# EAGLE board FresqueRVB (EAGLE 6.1), part 1 of 2
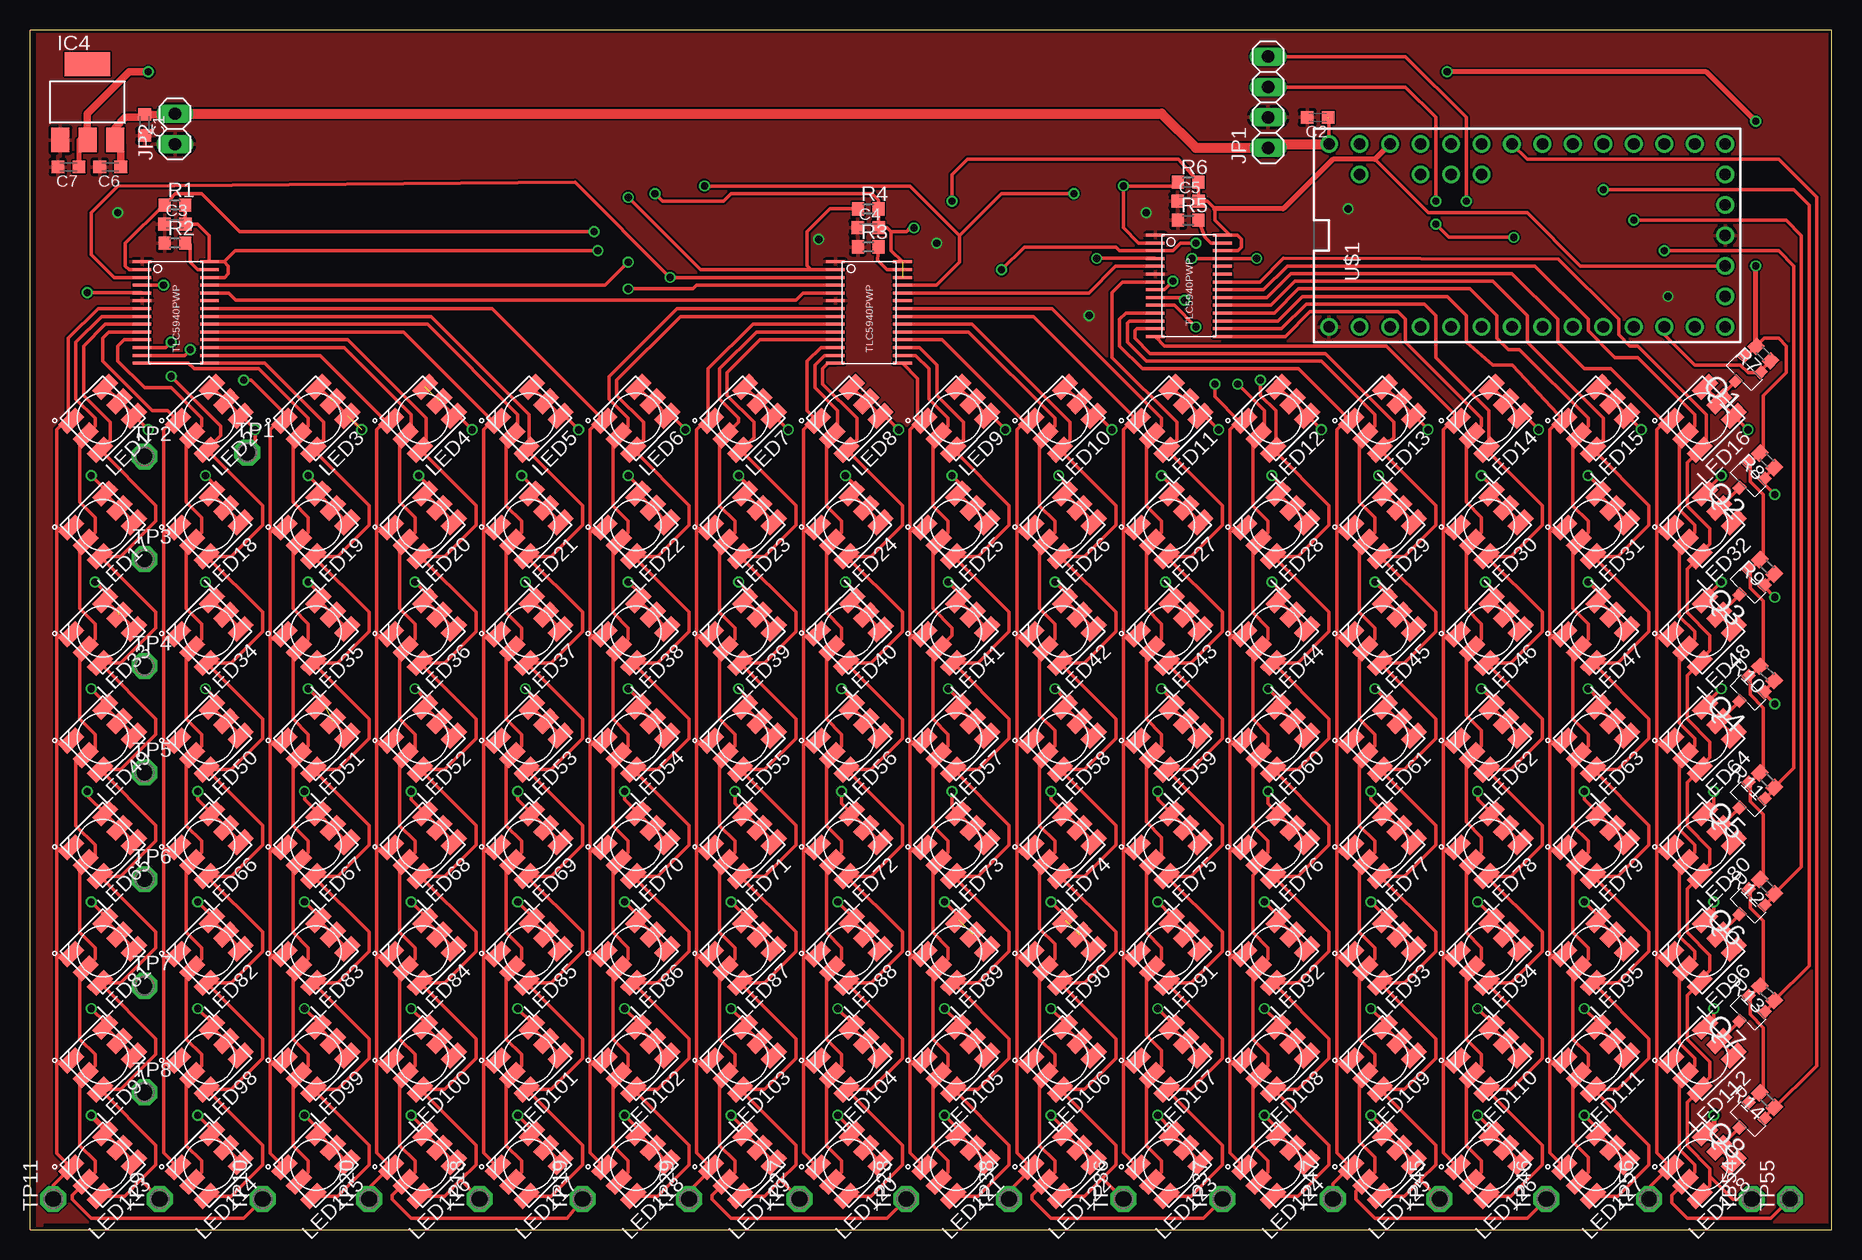
[diagram p1: board, top side]
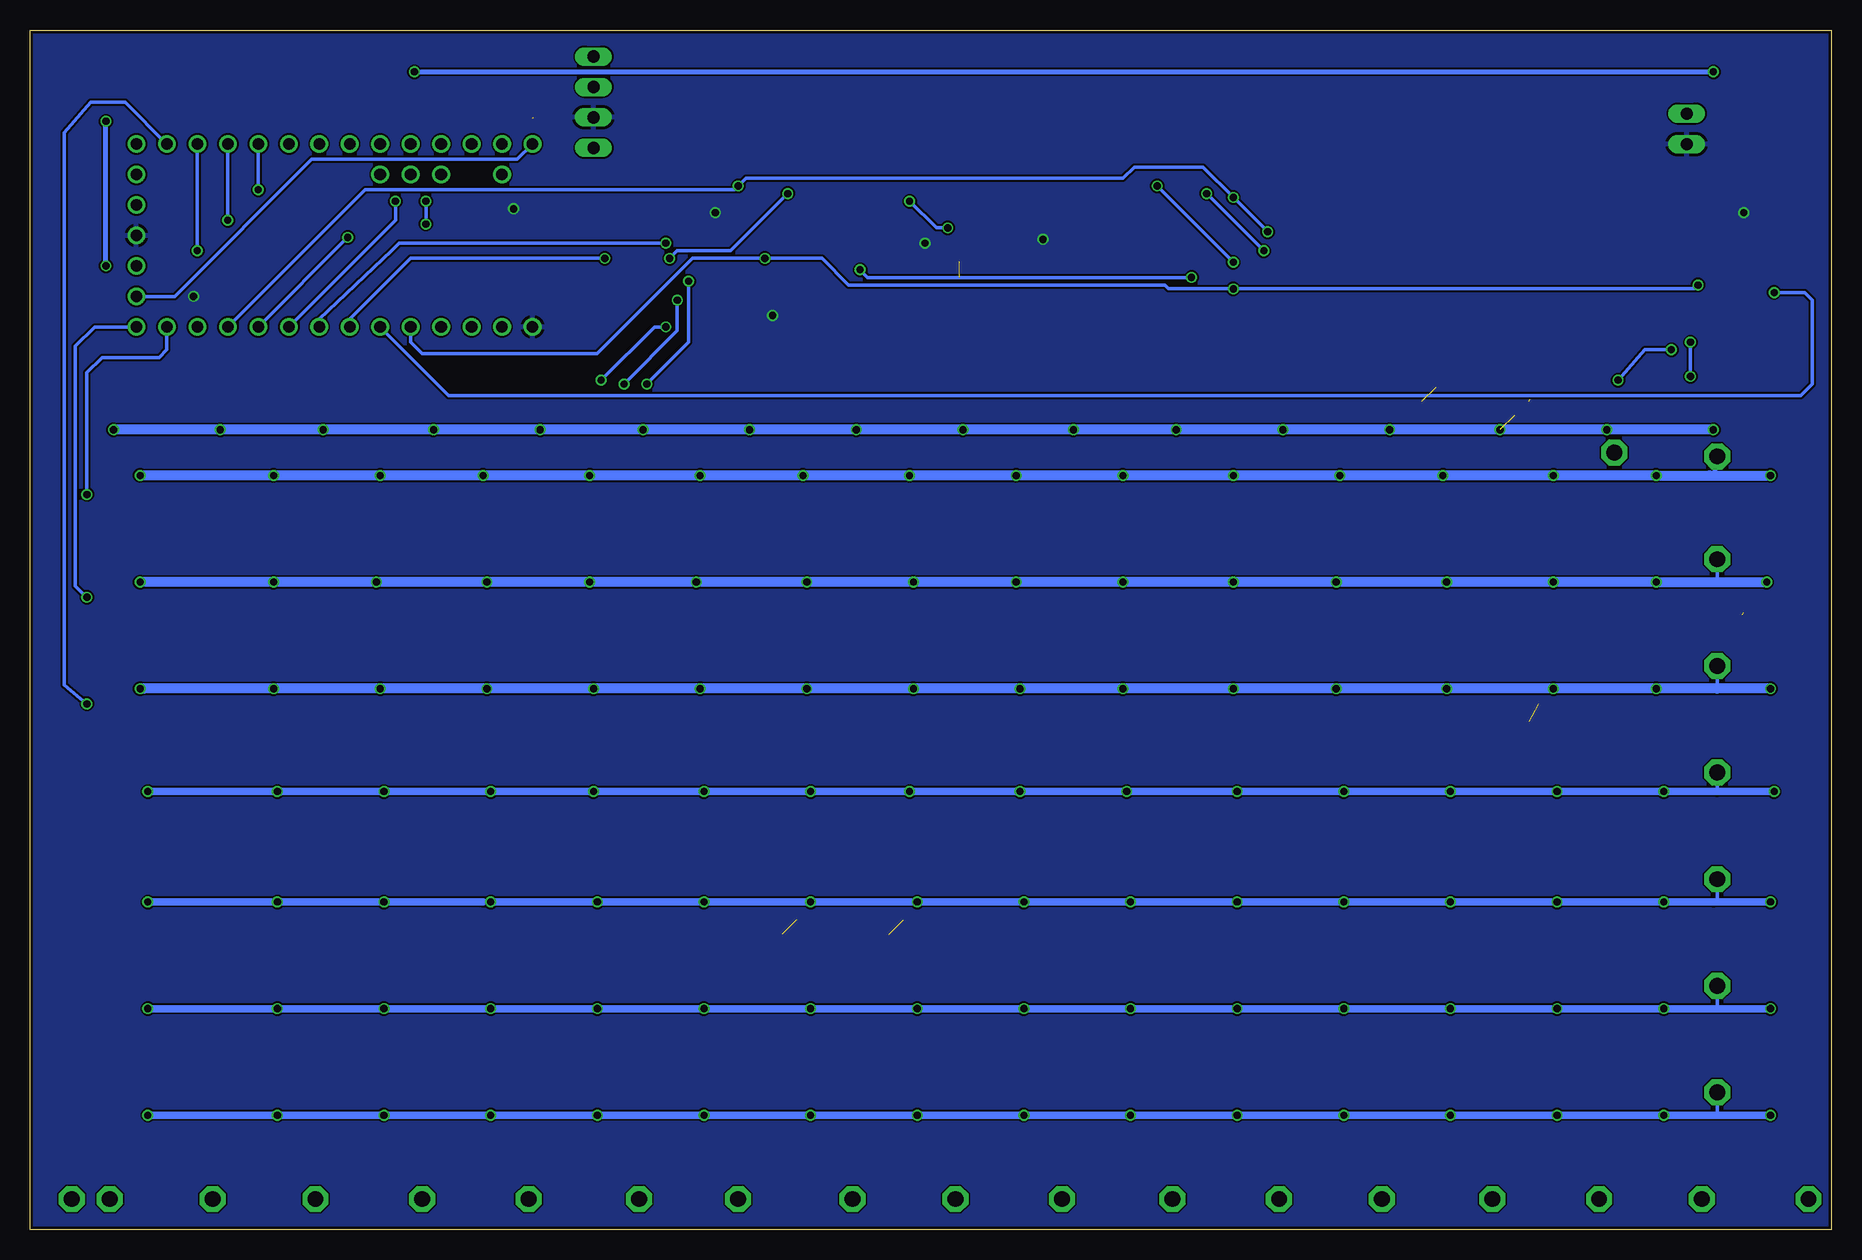
[diagram p2: board, bottom side, seen from below]

Size 150.18 x 100 mm. Coordinates in mm from the lower left corner, seen from the top.
Outline: 0.02,0 150.18,0 150.18,100 0.02,100
Outline: 0,0 0,100
Copper layers (1*16): Top 0.035mm / dielectric 1.5mm / Bottom 0.035mm
Design rules "SeeedStudio_DRU_no_angle_2layer": minimum track width 6mil, minimum drill 12mil, track to track 6mil, track to pad 6mil, pad to pad 6mil, via to via 6mil, smd to smd 0mil, copper to edge 10mil, drill to drill 10mil, minimum pad ring 10mil, minimum via ring 6mil, stop-mask expansion 2mil, vias tented up to drill 25mil, thermal gap 10mil

## Footprints (pad centres in the part's own frame; a part is rotated, then mirrored left to right if it is on the bottom)
C0603K = smd 1.05 x 1.08: 1 -0.875,0; 2 0.875,0
TCL5940_PWP = smd 0.25 x 1.55: 1 0.29,-5.6; 2 0.94,-5.6; 3 1.59,-5.6; 4 2.24,-5.6; 5 2.89,-5.6; 6 3.54,-5.6; 7 4.19,-5.6; 8 4.84,-5.6; 9 5.49,-5.6; 10 6.14,-5.6; 11 6.79,-5.6; 12 7.44,-5.6; 13 8.09,-5.6; 14 8.74,-5.6; 15 8.74,0; 16 8.09,0; 17 7.44,0; 18 6.79,0; 19 6.14,0; 20 5.49,0; 21 4.84,0; 22 4.19,0; 23 3.54,0; 24 2.89,0; 25 2.24,0; 26 1.59,0; 27 0.94,0; 28 0.29,0
SOT223 = smd 1.499 x 2.007: 1 -2.261,-3.15; 2 0.025,-3.15; 3 2.311,-3.15 | smd 3.81 x 2.007: 4 0,3.15
1X04 = drill 1.016 long: 1 -3.81,0; 2 -1.27,0; 3 1.27,0; 4 3.81,0
1X02 = drill 1.016 long: 1 -1.27,0; 2 1.27,0
RGBLED5050 = smd 2 x 1.1: 1 -2,1.7; 2 -2,0; 3 -2,-1.7; 4 2,-1.7; 5 2,0; 6 2,1.7
MICRO3 = smd 0.8 x 0.9: 1 -0.95,-1; 2 0.95,-1; 3 0,1
R0603 = smd 1 x 1.1: 1 -0.85,0; 2 0.85,0
P1-13 = drill 1.321 pad 2.159 octagon: TP 0,0
TEENSY_3.0+4 = drill 0.965: 0 -7.62,13.97; 1 -7.62,11.43; 2 -7.62,8.89; 3 -7.62,6.35; 3.3V 7.62,11.43; 3.3V1 -2.54,-16.51; 4 -7.62,3.81; 5 -7.62,1.27; 6 -7.62,-1.27; 7 -7.62,-3.81; 8 -7.62,-6.35; 9 -7.62,-8.89; 10 -7.62,-11.43; 11 -7.62,-13.97; 12 -7.62,-16.51; 13 7.62,-16.51; 14/A0 7.62,-13.97; 15/A1 7.62,-11.43; 16/A2 7.62,-8.89; 17/A3 7.62,-6.35; 18/A4 7.62,-3.81; 19/A5 7.62,-1.27; 20/A6 7.62,1.27; 21/A7 7.62,3.81; 22/A8 7.62,6.35; 23/A9 7.62,8.89; A10 5.08,6.35; A11 5.08,3.81; AGND 7.62,13.97; AREF 5.08,8.89; GND -7.62,16.51; GND1 0,-16.51; PGM 2.54,-16.51; RESET 5.08,-16.51; VBAT -5.08,-16.51; VIN 7.62,16.51; VUSB 5.08,13.97

## Placement (x,y rotation side)
C1  [C0603K]  9.54,92.08 270 top
C2  [C0603K]  107.33,92.71 180 top
C3  [C0603K]  12.08,83.82 0 top
C4  [C0603K]  69.87,83.5 0 top
C5  [C0603K]  96.54,85.72 0 top
C6  [C0603K]  6.69,88.58 180 top
C7  [C0603K]  3.19,88.58 180 top
IC1  [TCL5940_PWP]  14.94,80.96 270 top
IC2  [TCL5940_PWP]  72.73,80.96 270 top
IC3  [TCL5940_PWP]  99.4,83.19 270 top
IC4  REG1117  [SOT223]  4.78,93.98 0 top
JP1  [1X04]  103.21,93.98 90 top
JP2  [1X02]  12.08,91.76 90 top
LED1  RGBLED5050  [RGBLED5050]  6.05,67.63 225 top
LED2  RGBLED5050  [RGBLED5050]  14.94,67.63 225 top
LED3  RGBLED5050  [RGBLED5050]  23.83,67.63 225 top
LED4  RGBLED5050  [RGBLED5050]  32.72,67.63 225 top
LED5  RGBLED5050  [RGBLED5050]  41.61,67.63 225 top
LED6  RGBLED5050  [RGBLED5050]  50.5,67.63 225.1 top
LED7  RGBLED5050  [RGBLED5050]  59.39,67.63 225 top
LED8  RGBLED5050  [RGBLED5050]  68.28,67.63 225 top
LED9  RGBLED5050  [RGBLED5050]  77.17,67.63 225 top
LED10  RGBLED5050  [RGBLED5050]  86.06,67.63 225 top
LED11  RGBLED5050  [RGBLED5050]  94.95,67.63 225 top
LED12  RGBLED5050  [RGBLED5050]  103.84,67.63 225 top
LED13  RGBLED5050  [RGBLED5050]  112.73,67.63 225 top
LED14  RGBLED5050  [RGBLED5050]  121.62,67.63 225 top
LED15  RGBLED5050  [RGBLED5050]  130.51,67.63 225 top
LED16  RGBLED5050  [RGBLED5050]  139.4,67.63 225 top
LED17  RGBLED5050  [RGBLED5050]  6.05,58.74 225 top
LED18  RGBLED5050  [RGBLED5050]  14.94,58.74 225 top
LED19  RGBLED5050  [RGBLED5050]  23.83,58.74 225 top
LED20  RGBLED5050  [RGBLED5050]  32.72,58.74 225 top
LED21  RGBLED5050  [RGBLED5050]  41.61,58.74 225 top
LED22  RGBLED5050  [RGBLED5050]  50.5,58.74 225.1 top
LED23  RGBLED5050  [RGBLED5050]  59.39,58.74 225 top
LED24  RGBLED5050  [RGBLED5050]  68.28,58.74 225 top
LED25  RGBLED5050  [RGBLED5050]  77.17,58.74 225 top
LED26  RGBLED5050  [RGBLED5050]  86.06,58.74 225 top
LED27  RGBLED5050  [RGBLED5050]  94.95,58.74 225 top
LED28  RGBLED5050  [RGBLED5050]  103.84,58.74 225 top
LED29  RGBLED5050  [RGBLED5050]  112.73,58.74 225 top
LED30  RGBLED5050  [RGBLED5050]  121.62,58.74 225 top
LED31  RGBLED5050  [RGBLED5050]  130.51,58.74 225 top
LED32  RGBLED5050  [RGBLED5050]  139.4,58.74 225 top
LED33  RGBLED5050  [RGBLED5050]  6.05,49.85 225 top
LED34  RGBLED5050  [RGBLED5050]  14.94,49.85 225 top
LED35  RGBLED5050  [RGBLED5050]  23.83,49.85 225 top
LED36  RGBLED5050  [RGBLED5050]  32.72,49.85 225 top
LED37  RGBLED5050  [RGBLED5050]  41.61,49.85 225 top
LED38  RGBLED5050  [RGBLED5050]  50.5,49.85 225 top
LED39  RGBLED5050  [RGBLED5050]  59.39,49.85 225 top
LED40  RGBLED5050  [RGBLED5050]  68.28,49.85 224.1 top
LED41  RGBLED5050  [RGBLED5050]  77.17,49.85 225 top
LED42  RGBLED5050  [RGBLED5050]  86.06,49.85 225 top
LED43  RGBLED5050  [RGBLED5050]  94.95,49.85 225 top
LED44  RGBLED5050  [RGBLED5050]  103.84,49.85 225 top
LED45  RGBLED5050  [RGBLED5050]  112.73,49.85 225 top
LED46  RGBLED5050  [RGBLED5050]  121.62,49.85 225 top
LED47  RGBLED5050  [RGBLED5050]  130.51,49.85 225 top
LED48  RGBLED5050  [RGBLED5050]  139.4,49.85 225 top
LED49  RGBLED5050  [RGBLED5050]  6.05,40.96 225 top
LED50  RGBLED5050  [RGBLED5050]  14.94,40.96 225 top
LED51  RGBLED5050  [RGBLED5050]  23.83,40.96 225 top
LED52  RGBLED5050  [RGBLED5050]  32.72,40.96 225 top
LED53  RGBLED5050  [RGBLED5050]  41.61,40.96 225 top
LED54  RGBLED5050  [RGBLED5050]  50.5,40.96 225 top
LED55  RGBLED5050  [RGBLED5050]  59.39,40.96 225 top
LED56  RGBLED5050  [RGBLED5050]  68.28,40.96 225 top
LED57  RGBLED5050  [RGBLED5050]  77.17,40.96 225 top
LED58  RGBLED5050  [RGBLED5050]  86.06,40.96 225 top
LED59  RGBLED5050  [RGBLED5050]  94.95,40.96 225 top
LED60  RGBLED5050  [RGBLED5050]  103.84,40.96 225 top
LED61  RGBLED5050  [RGBLED5050]  112.73,40.96 225 top
LED62  RGBLED5050  [RGBLED5050]  121.62,40.96 225 top
LED63  RGBLED5050  [RGBLED5050]  130.51,40.96 225 top
LED64  RGBLED5050  [RGBLED5050]  139.4,40.96 225 top
LED65  RGBLED5050  [RGBLED5050]  6.05,32.07 225 top
LED66  RGBLED5050  [RGBLED5050]  14.94,32.07 225 top
LED67  RGBLED5050  [RGBLED5050]  23.83,32.07 225 top
LED68  RGBLED5050  [RGBLED5050]  32.72,32.07 225 top
LED69  RGBLED5050  [RGBLED5050]  41.61,32.07 225 top
LED70  RGBLED5050  [RGBLED5050]  50.5,32.07 225 top
LED71  RGBLED5050  [RGBLED5050]  59.39,32.07 225 top
LED72  RGBLED5050  [RGBLED5050]  68.28,32.07 225 top
LED73  RGBLED5050  [RGBLED5050]  77.17,32.07 225 top
LED74  RGBLED5050  [RGBLED5050]  86.06,32.07 225 top
LED75  RGBLED5050  [RGBLED5050]  94.95,32.07 225 top
LED76  RGBLED5050  [RGBLED5050]  103.84,32.07 225 top
LED77  RGBLED5050  [RGBLED5050]  112.73,32.07 225 top
LED78  RGBLED5050  [RGBLED5050]  121.62,32.07 225 top
LED79  RGBLED5050  [RGBLED5050]  130.51,32.07 225 top
LED80  RGBLED5050  [RGBLED5050]  139.4,32.07 225 top
LED81  RGBLED5050  [RGBLED5050]  6.05,23.18 225 top
LED82  RGBLED5050  [RGBLED5050]  14.94,23.18 225 top
LED83  RGBLED5050  [RGBLED5050]  23.83,23.18 225 top
LED84  RGBLED5050  [RGBLED5050]  32.72,23.18 225 top
LED85  RGBLED5050  [RGBLED5050]  41.61,23.18 225 top
LED86  RGBLED5050  [RGBLED5050]  50.5,23.18 225 top
LED87  RGBLED5050  [RGBLED5050]  59.39,23.18 225 top
LED88  RGBLED5050  [RGBLED5050]  68.28,23.18 225 top
LED89  RGBLED5050  [RGBLED5050]  77.17,23.18 225 top
LED90  RGBLED5050  [RGBLED5050]  86.06,23.18 225 top
LED91  RGBLED5050  [RGBLED5050]  94.95,23.18 225 top
LED92  RGBLED5050  [RGBLED5050]  103.84,23.18 225 top
LED93  RGBLED5050  [RGBLED5050]  112.73,23.18 225 top
LED94  RGBLED5050  [RGBLED5050]  121.62,23.18 225 top
LED95  RGBLED5050  [RGBLED5050]  130.51,23.18 225 top
LED96  RGBLED5050  [RGBLED5050]  139.4,23.18 225 top
LED97  RGBLED5050  [RGBLED5050]  6.05,14.29 225 top
LED98  RGBLED5050  [RGBLED5050]  14.94,14.29 225 top
LED99  RGBLED5050  [RGBLED5050]  23.83,14.29 225 top
LED100  RGBLED5050  [RGBLED5050]  32.72,14.29 225 top
LED101  RGBLED5050  [RGBLED5050]  41.61,14.29 225 top
LED102  RGBLED5050  [RGBLED5050]  50.5,14.29 225 top
LED103  RGBLED5050  [RGBLED5050]  59.39,14.29 225 top
LED104  RGBLED5050  [RGBLED5050]  68.28,14.29 225 top
LED105  RGBLED5050  [RGBLED5050]  77.17,14.29 225 top
LED106  RGBLED5050  [RGBLED5050]  86.06,14.29 225 top
LED107  RGBLED5050  [RGBLED5050]  94.95,14.29 225 top
LED108  RGBLED5050  [RGBLED5050]  103.84,14.29 225 top
LED109  RGBLED5050  [RGBLED5050]  112.73,14.29 225 top
LED110  RGBLED5050  [RGBLED5050]  121.62,14.29 225 top
LED111  RGBLED5050  [RGBLED5050]  130.51,14.29 225 top
LED112  RGBLED5050  [RGBLED5050]  139.4,14.29 225 top
LED113  RGBLED5050  [RGBLED5050]  6.05,5.4 225 top
LED114  RGBLED5050  [RGBLED5050]  14.94,5.4 225 top
LED115  RGBLED5050  [RGBLED5050]  23.83,5.4 225 top
LED116  RGBLED5050  [RGBLED5050]  32.72,5.4 225 top
LED117  RGBLED5050  [RGBLED5050]  41.61,5.4 225 top
LED118  RGBLED5050  [RGBLED5050]  50.5,5.4 225 top
LED119  RGBLED5050  [RGBLED5050]  59.39,5.4 225 top
LED120  RGBLED5050  [RGBLED5050]  68.28,5.4 225 top
LED121  RGBLED5050  [RGBLED5050]  77.17,5.4 225 top
LED122  RGBLED5050  [RGBLED5050]  86.06,5.4 225 top
LED123  RGBLED5050  [RGBLED5050]  94.95,5.4 225 top
LED124  RGBLED5050  [RGBLED5050]  103.84,5.4 225 top
LED125  RGBLED5050  [RGBLED5050]  112.73,5.4 225 top
LED126  RGBLED5050  [RGBLED5050]  121.62,5.4 225 top
LED127  RGBLED5050  [RGBLED5050]  130.51,5.4 225 top
LED128  RGBLED5050  [RGBLED5050]  139.4,5.4 225 top
Q1  IRLML5203  [MICRO3]  142.9,71.44 135 top
Q2  IRLML5203  [MICRO3]  143.21,62.55 135 top
Q3  IRLML5203  [MICRO3]  143.21,53.66 135 top
Q4  IRLML5203  [MICRO3]  143.21,44.77 135 top
Q5  IRLML5203  [MICRO3]  143.21,35.88 135 top
Q6  IRLML5203  [MICRO3]  143.21,26.99 135 top
Q7  IRLML5203  [MICRO3]  143.21,18.1 135 top
Q8  IRLML5203  [MICRO3]  143.21,9.21 135 top
R1  10K  [R0603]  12.08,85.41 0 top
R2  2K  [R0603]  12.08,82.23 0 top
R3  2K  [R0603]  69.87,81.92 0 top
R4  10K  [R0603]  69.87,85.09 0 top
R5  2K  [R0603]  96.54,84.14 0 top
R6  10K  [R0603]  96.54,87.31 0 top
R7  [R0603]  144.48,73.03 135 top
R8  [R0603]  144.8,64.14 135 top
R9  [R0603]  144.8,55.24 135 top
R10  [R0603]  144.8,46.35 135 top
R11  [R0603]  144.8,37.47 135 top
R12  [R0603]  144.8,28.57 135 top
R13  [R0603]  144.8,19.68 135 top
R14  [R0603]  144.8,10.79 135 top
TP1  TPPAD1-13  [P1-13]  18.12,64.77 0 top
TP2  TPPAD1-13  [P1-13]  9.54,64.45 0 top
TP3  TPPAD1-13  [P1-13]  9.54,55.88 0 top
TP4  TPPAD1-13  [P1-13]  9.54,46.99 0 top
TP5  TPPAD1-13  [P1-13]  9.54,38.1 0 top
TP6  TPPAD1-13  [P1-13]  9.54,29.21 0 top
TP7  TPPAD1-13  [P1-13]  9.54,20.32 0 top
TP8  TPPAD1-13  [P1-13]  9.54,11.43 0 top
TP9  TPPAD1-13  [P1-13]  10.81,2.54 90 top
TP10  TPPAD1-13  [P1-13]  19.39,2.54 90 top
TP11  TPPAD1-13  [P1-13]  1.93,2.54 90 top
TP18  TPPAD1-13  [P1-13]  37.49,2.54 90 top
TP19  TPPAD1-13  [P1-13]  46.06,2.54 90 top
TP20  TPPAD1-13  [P1-13]  28.28,2.54 90 top
TP27  TPPAD1-13  [P1-13]  64.16,2.54 90 top
TP28  TPPAD1-13  [P1-13]  73.05,2.54 90 top
TP29  TPPAD1-13  [P1-13]  54.95,2.54 90 top
TP36  TPPAD1-13  [P1-13]  91.14,2.54 90 top
TP37  TPPAD1-13  [P1-13]  99.4,2.54 90 top
TP38  TPPAD1-13  [P1-13]  81.62,2.54 90 top
TP45  TPPAD1-13  [P1-13]  117.49,2.54 90 top
TP46  TPPAD1-13  [P1-13]  126.38,2.54 90 top
TP47  TPPAD1-13  [P1-13]  108.6,2.54 90 top
TP54  TPPAD1-13  [P1-13]  143.53,2.54 90 top
TP55  TPPAD1-13  [P1-13]  146.71,2.54 90 top
TP56  TPPAD1-13  [P1-13]  134.96,2.54 90 top
U$1  TEENSY_3.0+4  [TEENSY_3.0+4]  124.8,82.87 90 top